# EAGLE design SparkFun_Magnetometer_MMC5983MA_Qwiic_Micro (EAGLE 9.6.2)
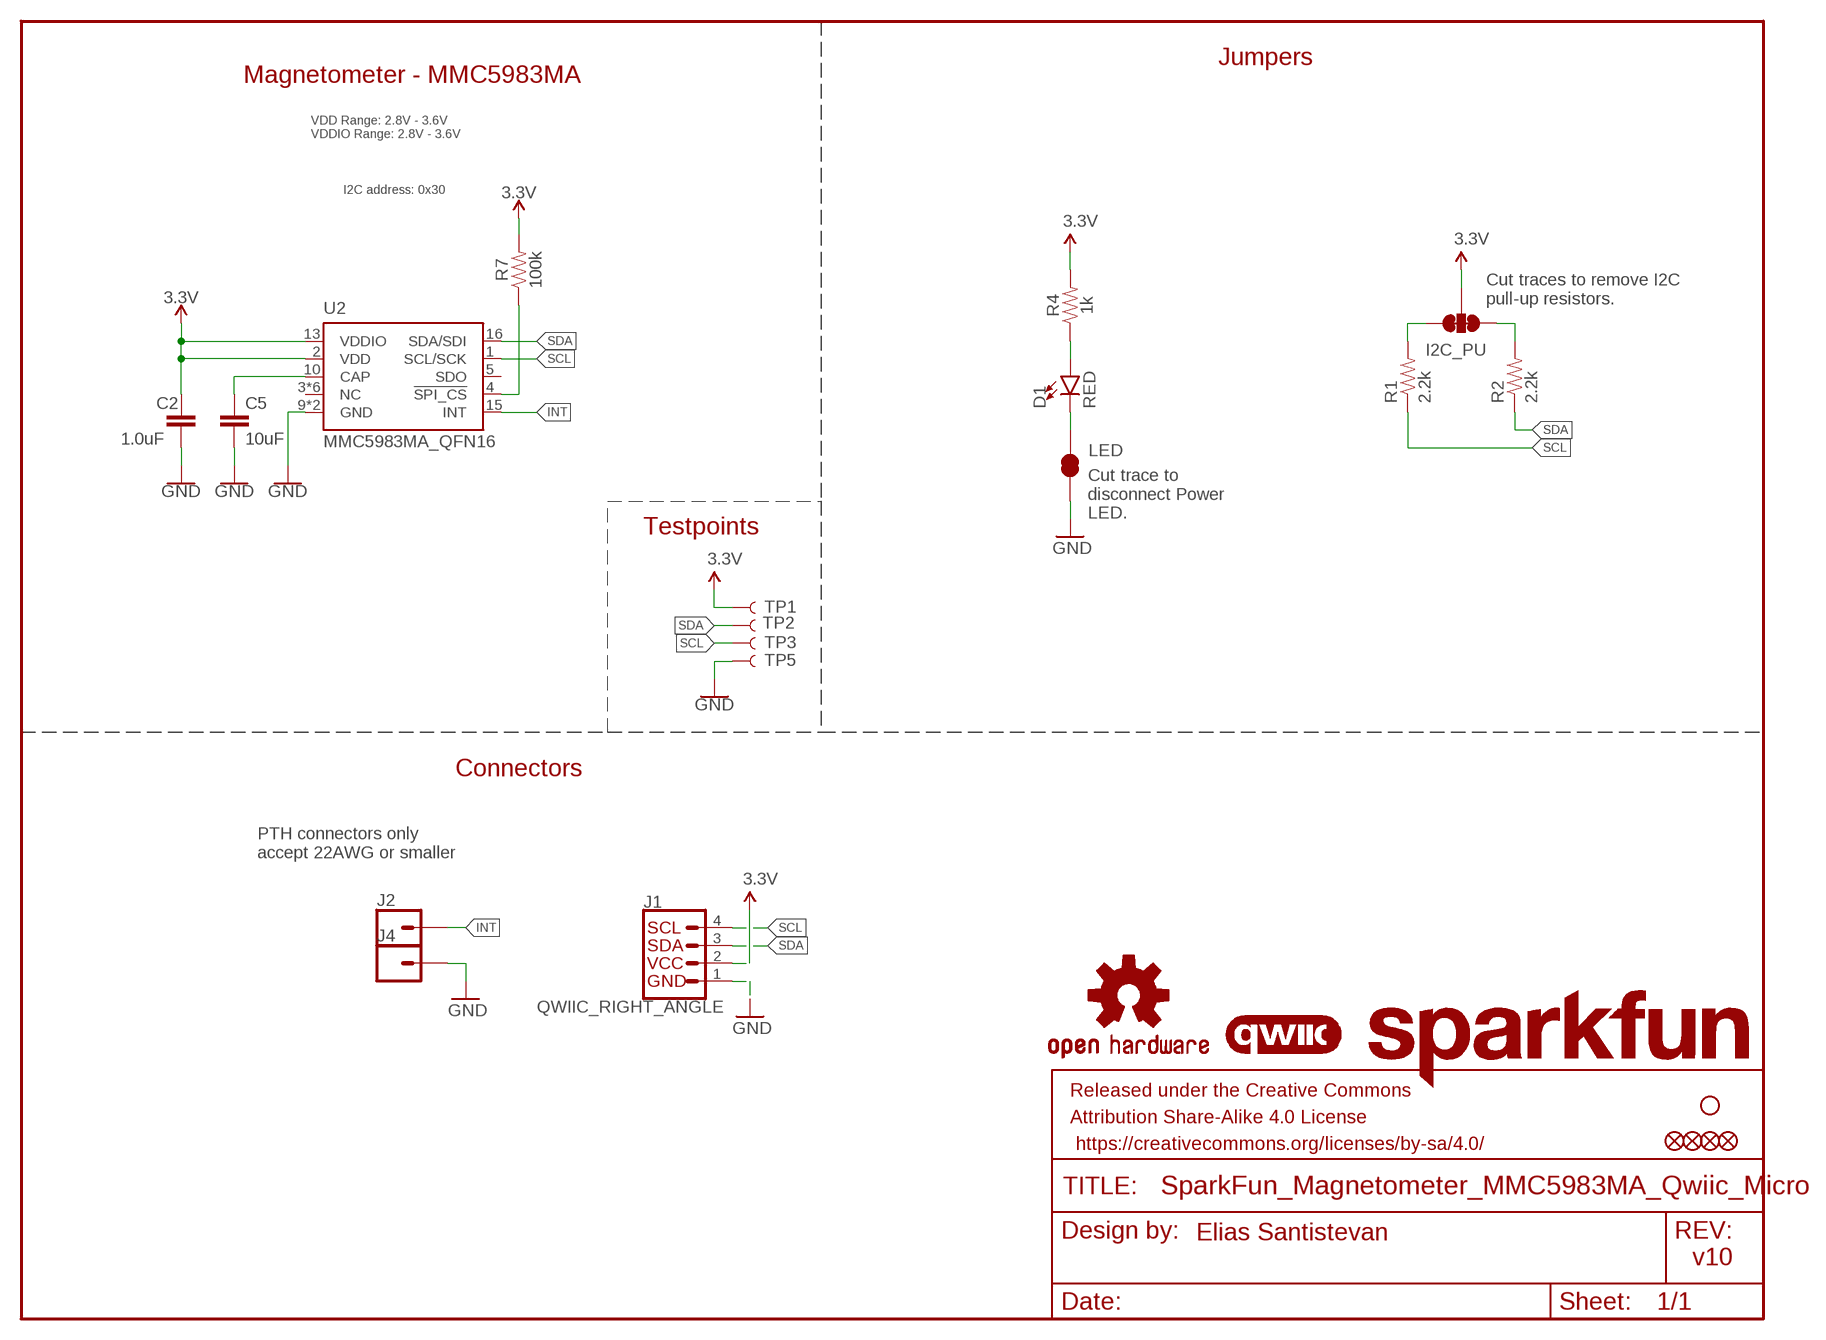
[diagram p0: schematic, sheet 1]

## Parts
C2  1.0uF  1.0UF-0402T-16V-10%  [0402-TIGHT]
C5  10uF  10UF-0402T-6.3V-20%  [0402-TIGHT]
D1  RED  LED-RED_0402  [LED-0402]
FD1  FIDUCIALUFIDUCIAL  [FIDUCIAL-MICRO]
FD2  FIDUCIALUFIDUCIAL  [FIDUCIAL-MICRO]
FID1  FIDUCIALUFIDUCIAL  [FIDUCIAL-MICRO]
FID2  FIDUCIALUFIDUCIAL  [FIDUCIAL-MICRO]
FRAME1  FRAME-LETTER  [CREATIVE_COMMONS]
I2C_PU  S_MODE  JUMPER-SMT_3_2-NC_TRACE_SILK  [SMT-JUMPER_3_2-NC_TRACE_SILK]
J1  QWIIC_RIGHT_ANGLE  QWIIC_CONNECTORJS-1MM  [JST04_1MM_RA]
J2  CONN_01_1MM  [1X01_1MM_NO_SILK]
J4  CONN_01_1MM  [1X01_1MM_NO_SILK]
LED  JUMPER-SMT_2_NC_TRACE_SILK  [SMT-JUMPER_2_NC_TRACE_SILK]
LOGO1  QWIIC_LOGO_4MM  [QWIIC_4MM]
LOGO2  OSHW-LOGOMINI  [OSHW-LOGO-MINI]
LOGO3  SFE_LOGO_NAMEBLANK  [BLANK]
R1  2.2k  2.2KOHM-0402T-1/16W-1%  [0402-TIGHT]
R2  2.2k  2.2KOHM-0402T-1/16W-1%  [0402-TIGHT]
R4  1k  1KOHM-0402T-1/16W-1%  [0402-TIGHT]
R7  100k  100KOHM-0402T-1/16W-1%  [0402-TIGHT]
STANDOFF3  STAND-OFFTIGHT  [STAND-OFF-TIGHT]
TP1  TEST-POINT3  [PAD.03X.03]
TP2  TEST-POINT3  [PAD.03X.03]
TP3  TEST-POINT3  [PAD.03X.03]
TP5  TEST-POINT3  [PAD.03X.03]
U2  MMC5983MA_QFN16  [LGA-16-3X3MM-4X4PINS]

## Nets
3.3V: C2.1 I2C_PU.2 J1.2 R4.2 R7.2 TP1.1 U2.2(VDD) U2.13(VDDIO)
!MAG_CS!: R7.1 U2.4(!SPI_CS!)
CAP: C5.1 U2.10(CAP)
GND: C2.2 C5.2 J1.1 J4.1 LED.1 TP5.1 U2.9(GND) U2.11(GND)
INT: J2.1 U2.15(INT)
N$2: D1.A R4.1
N$3: D1.C LED.2
N$5: I2C_PU.1 R1.2
N$6: I2C_PU.3 R2.2
SCL: J1.4 R1.1 TP3.1 U2.1(SCL/SCK)
SDA: J1.3 R2.1 TP2.1 U2.16(SDA/SDI)
Unconnected: U2.3(NC) U2.5(SDO) U2.6(NC) U2.7(NC) U2.8(NC) U2.12(NC) U2.14(NC)

## Notes on the sheet
- Jumpers
- Magnetometer - MMC5983MA
- VDD Range: 2.8V - 3.6V
  VDDIO Range: 2.8V - 3.6V
- I2C address: 0x30
- Cut traces to remove I2C
  pull-up resistors.
- Cut trace to
  disconnect Power
  LED.
- Testpoints
- Connectors
- PTH connectors only 
  accept 22AWG or smaller
- Elias Santistevan
- v10

## Library data of the parts
C2 = SparkFun-Capacitors:1.0UF: 1µF ceramic capacitors A capacitor is a passive two-terminal electrical component used to store electrical energy temporarily in an electric field.; PROD_ID: CAP-12417
C5 = SparkFun-Capacitors:10UF: 10.0µF ceramic capacitors A capacitor is a passive two-terminal electrical component used to store electrical energy temporarily in an electric field.; PROD_ID: CAP-14848
D1 = SparkFun-LED:LED-RED: Red SMD LED Used in manufacturing of most products at SparkFun Packages: 0603 - SMD 0603 package [Product Link] <http://docs.avagotech.com/docs/AV02-0551EN> 0603 SMART - SMD 0603 SMART package ( more efficient and expensive)[Product Link] <http://www.osram-os.com/Graphics/XPic2/00077099_0.pdf> 1206 - SMD1206 package [Product Link] <https://www.sparkfun.com/datasheets/DevTools/LilyPad/Q150OVS4.pdff> SparkFun Products: Pro Mini 328 -5V <https://www.sparkfun.com/products/821> RedBoard <https://www.sparkfun.com/products/12757> IOIO-OTG <https://www.sparkfun.com/products/13613>; PROD_ID: DIO-16757
FD1 FD2 FID1 FID2 = SparkFun-Aesthetics:FIDUCIAL: Fiducial Alignment Points Point-of-reference for pick-and-place machines and other optical instruments.
FRAME1 = SparkFun-Aesthetics:FRAME-LETTER: Schematic Frame - Letter Standard 8.5x11 US Letter frame; DESIGNER: Elias Santistevan
I2C_PU = SparkFun-Jumpers:JUMPER-SMT_3_2-NC_TRACE: Normally closed trace jumper (2 of 2 connections) This jumper has a trace between all three pads so they are normally closed (NC). Use a razor knife to open the connection(s). For best results follow the IPC guidelines for cutting traces: Cutout at least 0.063 mm (0.005 in). Remove all loose material to clean up the cut area. Seal the cut with an approved epoxy. Reapply solder to reclose the connection(s).
J1 = SparkFun-Connectors:QWIIC_CONNECTOR: SparkFun I2C Standard Qwiic Connector An SMD 1mm pitch JST connector makes it easy and quick (get it? Qwiic?) to connect I2C devices to each other. The Qwiic system <http://www.sparkfun.com/qwiic> enables fast and solderless connection between popular platforms and various sensors and actuators. We carry 200mm <https://www.sparkfun.com/products/14204>, 100mm <https://www.sparkfun.com/products/14205>, 50mm <https://www.sparkfun.com/products/14206>, and breadboard friendly <https://www.sparkfun.com/products/14207> Qwiic cables. We also offer 10 pcs strips <https://www.sparkfun.com/products/14323> the SMD connectors.; PROD_ID: CONN-13694
J2 J4 = SparkFun-Connectors:CONN_01: Single connection point. Often used as Generic Header-pin footprint for 0.1 inch spaced/style header connections On any of the 0.1 inch spaced packages, you can populate with these: Break Away Headers - Straight <https://www.sparkfun.com/products/116> (PRT-00116) Break Away Male Headers - Right Angle <https://www.sparkfun.com/products/553> (PRT-00553) Female Headers <https://www.sparkfun.com/products/115> (PRT-00115) Break Away Headers - Machine Pin <https://www.sparkfun.com/products/117> (PRT-00117) Break Away Female Headers - Swiss Machine Pin <https://www.sparkfun.com/products/743> (PRT-00743) This device is also useful as a general connection point to wire up your design to another part of your project. Our various solder wires solder well into these plated through hole pads. Hook-Up Wire - Assortment (Stranded, 22 AWG) <https://www.sparkfun.com/products/11375> (PRT-11375) Hook-Up Wire - Assortment (Solid Core, 22 AWG) <https://www.sparkfun.com/products/11367> (PRT-11367) View the entire wire category on our website here <https://www.sparkfun.com/categories/141> Special notes: SMTSO-256-ET is a "flush mount" nut for a 4-40 screw. We mostly use this on specialty testbeds; it is a nice way to connect hardware to your PCB at an adjustable hieght. Also note, the SNAP packages are for using a snappable style connector. We sell a baggie of snaps and they are also used on two LilyPad designs: Snap Assortment - 30 pack (male and female) <https://www.sparkfun.com/products/11347> (DEV-11347) LilyPad Arduino SimpleSnap <https://www.sparkfun.com/products/10941> (DEV-10941) LilyPad SimpleSnap Protoboard <https://www.sparkfun.com/products/10940> (DEV-10940)
LED = SparkFun-Jumpers:JUMPER-SMT_2_NC_TRACE: Normally closed trace jumper This jumper has a trace between two pads so it's normally closed (NC). Use a razor knife to open the connection. For best results follow the IPC guidelines for cutting traces: Cutout at least 0.063 mm (0.005 in). Remove all loose material to clean up the cut area. Seal the cut with an approved epoxy. Reapply solder to reclose the connection.
LOGO1 = SparkFun-Aesthetics:QWIIC_LOGO: Qwiic Logos for placement on schematic and PCB. The 5.5mm silk logo is best for placing next to Qwiic connector.
LOGO2 = SparkFun-Aesthetics:OSHW-LOGO: Open-Source Hardware (OSHW) Logo This logo indicates the piece of hardware it is found on incorporates a OSHW license and/or adheres to the definition of open source hardware found here: http://freedomdefined.org/OSHW
LOGO3 = SparkFun-Aesthetics:SFE_LOGO_NAME: SparkFun Font Logo This is the SparkFun name logo. The logo on the schematic will always be the same size; the package variant is the height of the flame part of the logo (or the height the flame would be, if it were drawn). Default layer for the logo on the board is tSilk.
R1 R2 = SparkFun-Resistors:2.2KOHM: 2.2kΩ resistor A resistor is a passive two-terminal electrical component that implements electrical resistance as a circuit element. Resistors act to reduce current flow, and, at the same time, act to lower voltage levels within circuits. - Wikipedia; PROD_ID: RES-14341
R4 = SparkFun-Resistors:1KOHM: 1kΩ resistor A resistor is a passive two-terminal electrical component that implements electrical resistance as a circuit element. Resistors act to reduce current flow, and, at the same time, act to lower voltage levels within circuits. - Wikipedia; PROD_ID: RES-14342
R7 = SparkFun-Resistors:100KOHM: 100kΩ resistor A resistor is a passive two-terminal electrical component that implements electrical resistance as a circuit element. Resistors act to reduce current flow, and, at the same time, act to lower voltage levels within circuits. - Wikipedia; PROD_ID: RES-13495
STANDOFF3 = SparkFun-Hardware:STAND-OFF: Stand Off Drill holes for mechanically mounting via screws, standoffs, etc. Note: Use the keepout ring to avoid running the screw head into surrounding components. Variant Overviews STAND-OFF - Mechanical footprint for a #4 phillips button head screw. STAND-OFF-TIGHT - Mechanical footprint for a #4 phillips button head screw, Example SparkFun Products Screw - Phillips Head (1/4", 4-40, 10 pack) <https://www.sparkfun.com/products/10453> (PRT-10453) Screw - Phillips Head (1/2", 4-40, 10 pack) <https://www.sparkfun.com/products/10452> (PRT-10452) Screw - Phillips Head (3/4", 4-40, 10 pack) <https://www.sparkfun.com/products/10451> (PRT-10451) Screw - Phillips Head (1", 4-40, 10 pack) <https://www.sparkfun.com/products/10450> (PRT-10450)
TP1-TP3 TP5 = SparkFun-Connectors:TEST-POINT: SparkFun Test Points Bare copper test points for troubleshooting or In-Circuit-Testing. These are used by our Production team for verifying production board runs using pogo-pins on test beds. SparkFun Products: SparkFun LSM9DS1 Breakout <https://www.sparkfun.com/products/13284> SparkFun PSOC <https://www.sparkfun.com/products/13714> SparkFun Load Cell Amplifier <https://www.sparkfun.com/products/13879>
U2 = SparkFun-Sensors:MMC5983MA: High Performance 3-axis Magnetic Sensor The MMC5983MA is an AEC-Q100 qualified complete 3-axis magnetic sensor with on-chip signal processing and integrated I2C/SPI bus suitable for use in automotive applications. The device can be connected directly to a microprocessor, eliminating the need for A/D converters or timing resources. It can measure magnetic fields within the full scale range of ±8 Gauss (G), with 0.25mG/0.0625mG per LSB resolution at 16bits/18bits operation mode and 0.4 mG total RMS noise level, enabling heading accuracy of ±0.5° in electronic compass applications.; PROD_ID: IC-16314

## Board
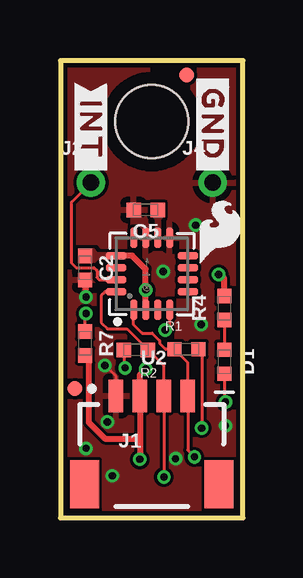
[diagram p1: board, top side]
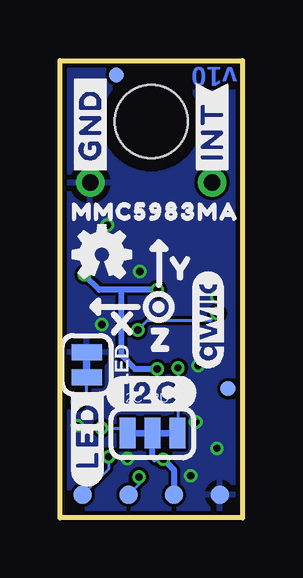
[diagram p2: board, bottom side, seen from below]

Size 7.62 x 19.05 mm. Coordinates in mm from the lower left corner, seen from the top.
Outline: 7.62,0 7.62,19.05 0,19.05 0,0 7.62,0
Copper layers (1*16): Top 0.035mm / dielectric 1.5mm / Bottom 0.035mm
Design rules "SparkFun-2-Layer-Minimum-JLCPCB": minimum track width 5mil, minimum drill 0.3mm, track to track 5mil, track to pad 5mil, pad to pad 5mil, via to via 5mil, smd to smd 5mil, copper to edge 7mil, drill to drill 7mil, minimum pad ring 5mil, minimum via ring 5mil, stop-mask expansion 2.5mil, vias tented up to drill 25mil, thermal gap 10mil

### Footprints (pad centres in the part's own frame; a part is rotated, then mirrored left to right if it is on the bottom)
0402-TIGHT = smd 0.6 x 0.6: 1 -0.5,0; 2 0.5,0
LED-0402 = smd 0.6 x 0.6: A -0.5,0; C 0.5,0
FIDUCIAL-MICRO = smd 0.635 x 0.635: 1 0,0
SMT-JUMPER_3_2-NC_TRACE_SILK = smd 0.66 x 1.27: 1 -1.041,0; 2 0,0; 3 1.041,0
JST04_1MM_RA = smd 0.6 x 1.35: 1 -1.5,0; 2 -0.5,0; 3 0.5,0; 4 1.5,0 | smd 1.2 x 2: NC1 2.8,-3.675; NC2 -2.8,-3.675
1X01_1MM_NO_SILK = drill 0.7 pad 1.2: 1 0,0
SMT-JUMPER_2_NC_TRACE_SILK = smd 0.66 x 1.27: 1 -0.521,0; 2 0.521,0
STAND-OFF-TIGHT = hole 3.048: 0,0
PAD.03X.03 = smd 0.762 x 0.762: 1 0,0
LGA-16-3X3MM-4X4PINS = smd 0.3 x 0.85: 1 0.754,1.498; 2 0.254,1.498; 3 -0.246,1.498; 4 -0.746,1.498; 9 -0.746,-1.506; 10 -0.246,-1.506; 11 0.254,-1.506; 12 0.754,-1.506 | smd 0.85 x 0.3: 5 -1.508,0.746; 6 -1.508,0.246; 7 -1.508,-0.254; 8 -1.508,-0.754; 13 1.496,-0.764; 14 1.496,-0.264; 15 1.496,0.236; 16 1.496,0.736

### Placement (x,y rotation side)
C2  1.03,10.41 270 top
C5  3.56,12.83 180 top
D1  6.84,6.5 270 top
FD1  5.26,18.44 90 bottom
FD2  0.61,5.38 90 bottom
FID1  5.26,18.44 270 top
FID2  0.61,5.38 270 top
FRAME1  -18.8,-19.05 0 top  (outside the outline)
I2C_PU  3.76,3.52 0 bottom
J1  3.81,5.08 0 top
J2  1.27,13.97 0 top
J4  6.35,13.97 0 top
LED  6.5,6.38 270 bottom
LOGO1  1.42,8.26 90 bottom
LOGO2  5.87,10.98 0 bottom
LOGO3  -39.05,-20.95 0 top  (outside the outline)
R1  5.26,7.02 0 top
R2  3.15,7 180 top
R4  6.84,8.74 90 top
R7  1.03,7.26 270 top
STANDOFF3  3.81,16.51 270 top
TP1  2.86,0.95 90 bottom
TP2  4.76,0.95 90 bottom
TP3  6.67,0.95 90 bottom
TP5  0.95,0.95 90 bottom
U2  3.81,10.16 180 top
U$1  [#INT#20]  1.27,16.13 270 top
U$2  [MMC5983MA331]  3.63,12.75 0 bottom
U$3  [#I2C#4]  3.81,5.21 0 bottom
U$4  [#GND#4]  6.35,16.38 270 top
U$5  [#INT#21]  1.27,16.13 90 bottom
U$6  [#GND#4]  6.35,16.38 90 bottom
U$8  [X2114]  4.95,8.08 0 bottom
U$9  [Y2115]  2.52,10.39 0 bottom
U$10  [Z2116]  3.38,7.42 0 bottom
U$11  [#LED#5]  6.48,3.43 90 bottom
U$29  [SFE_LOGO_FLAME_.1]  6.65,11.94 0 top

### Tracks (layer width: path | path; a pad name or v marks a point on that pad's centre or on a via)
3.3V  (via drill 0.3)
  Top 0.254: 3.31,3.45 J1.2 3.31,5.95 v3.56,6.2 | 3.31,3.45 v3.31,2.45 v3.3,2.44 | U2.13 3,10.92 3.56,10.36 v3.56,9.5 U2.2 | R4.2 6.84,9.97 6.68,10.13 v6.6,10.13 | R7.2 1.18,6.76 1.18,3.98 1.85,3.3 3.16,3.3 3.31,3.45
  Bottom 0.254: I2C_PU.2 3.76,2.54 3.66,2.44 v3.3,2.44 2.86,1.99 TP1.1 | v3.56,9.5 5.05,9.5 | 5.05,9.5 5.97,9.5 v6.6,10.13 | v3.56,6.2 4.49,6.2 5.05,6.76 5.05,9.5
  pour Top (no thermals): 2.72,11.05 1.55,11.05 1.4,11.2 0.74,11.2 0.74,10.62 1.42,10.62 1.57,10.77 2.72,10.77
!MAG_CS!  (via drill 0.3)
  Top 0.127: U2.4 4.56,8.01 v4.37,7.82 | R7.1 1.03,8.47 v1.07,8.51
  Bottom 0.127: v1.07,8.51 1.07,8.48 1.35,8.2 3.99,8.2 v4.37,7.82
CAP
  pour Top (no thermals): 4.19,11.56 4.19,12.45 4.32,12.57 4.32,13.08 3.81,13.08 3.81,12.57 3.94,12.45 3.94,11.56
GND  (via drill 0.3)
  Top 0.127: J1.1 2.31,5.89 v1.85,6.35
  Top 0.254: v1.07,9.2 1.07,9.88 C2.2
  other vias: 1.07,2.9 1.96,3.99 5.87,8.05 6.88,3.84 4.8,2.46 5.64,12.19 4.29,10.26 2.16,1.75
  pour Bottom (isolate 0.127): 0,0 7.62,0 7.62,19.05 0,19.05
  pour Top (isolate 0.127, rank 2): 0,0 7.62,0 7.62,19.05 0,19.05
  pour Top (no thermals): 3.45,11.46 3.45,11.99 2.95,12.5 2.77,12.5 2.77,13.13 2.79,13.13 3.68,12.24 3.68,11.46
INT
  Top 0.127: U2.15 1.61,9.92 1.52,10.01 1.52,10.29 1.39,10.42 0.65,10.42 0.46,10.62 0.46,13.16 J2.1
N$2
  Top 0.127: R4.1 D1.A
N$3  (via drill 0.3)
  Top 0.127: D1.C 6.84,4.87 v6.88,4.83
  Bottom 0.127: v6.88,4.83 6.5,5.21 LED.2
N$5  (via drill 0.3)
  Top 0.127: R1.2 5.89,6.89 v5.89,3.73
  Bottom 0.127: v5.89,3.73 5.01,3.73 I2C_PU.1
N$6  (via drill 0.3)
  Top 0.127: R2.2 2.65,6.29 v2.69,6.25
  Bottom 0.127: v2.69,6.25 2.69,3.55 I2C_PU.3
SCL  (via drill 0.3)
  Top 0.127: U2.1 3.06,8.04 3.4,7.7 3.82,7.7 4.14,7.38 4.14,7.26 4.38,7.02 R1.1 5.31,6.47 J1.4 5.31,2.82 v5.59,2.54
  Bottom 0.127: TP3.1 5.59,2.03 v5.59,2.54
SDA  (via drill 0.3)
  Top 0.127: U2.16 1.85,9.42 1.7,9.27 1.7,8.13 1.96,7.87 2.77,7.87 R2.1 4.31,6.34 J1.3 v4.31,1.71 v4.32,1.7
  Bottom 0.127: v4.32,1.7 4.32,1.4 TP2.1

### Text on the board
Bottom: v10
Measures: Units in Inches